# Altium project Team_01 COMPSYS 301 PCB.PrjPcb
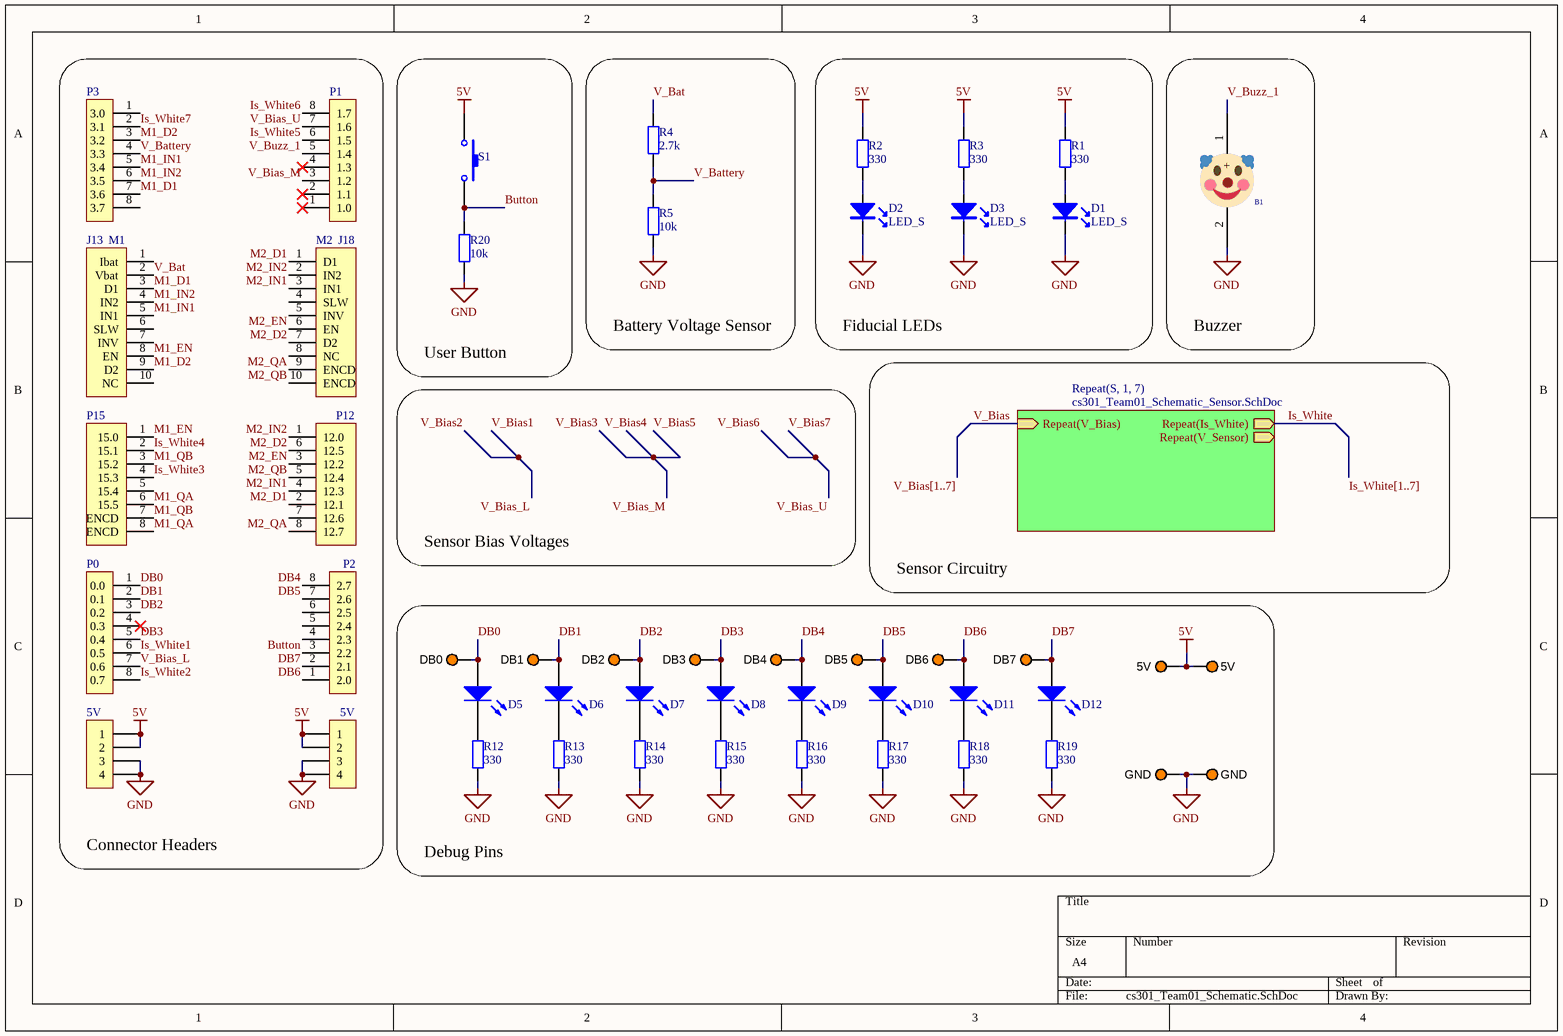
[diagram p0: cs301_Team01_Schematic.SchDoc]
2 sheets, 175 parts. Net scope: hierarchical (ports join the sheet entries above them; power ports are global).
Board file: cs301_Team01_Artwork.PcbDoc
Sheets:
  cs301_Team01_Schematic.SchDoc
    S1 = cs301_Team01_Schematic_Sensor.SchDoc
    S2 = cs301_Team01_Schematic_Sensor.SchDoc
    S3 = cs301_Team01_Schematic_Sensor.SchDoc
    S4 = cs301_Team01_Schematic_Sensor.SchDoc
    S5 = cs301_Team01_Schematic_Sensor.SchDoc
    S6 = cs301_Team01_Schematic_Sensor.SchDoc
    S7 = cs301_Team01_Schematic_Sensor.SchDoc

## Sheet cs301_Team01_Schematic.SchDoc
size A4; SheetNumber: 1; SheetTotal: 2

### Parts
5V  5V  [IDC4]  (value not drawn)
5V_1  5V  [TP_TH]
5V_2  5V  [TP_TH]
+5V  5V  [IDC4]
B1  clown  [Buzzer]  (value not drawn)
D1  LED_S  [LED0.1/5MM]
D2  LED_S  [LED0.1/5MM]
D3  LED_S  [LED0.1/5MM]
D5  0  [0805 LED]  (value not drawn)
D6  1  [0805 LED]  (value not drawn)
D7  2  [0805 LED]  (value not drawn)
D8  3  [0805 LED]  (value not drawn)
D9  4  [0805 LED]  (value not drawn)
D10  5  [0805 LED]  (value not drawn)
D11  6  [0805 LED]  (value not drawn)
D12  7  [0805 LED]  (value not drawn)
DB0  5003  [TP_TH]  (value not drawn)
DB1  5003  [TP_TH]  (value not drawn)
DB2  5003  [TP_TH]  (value not drawn)
DB3  5003  [TP_TH]  (value not drawn)
DB4  5003  [TP_TH]  (value not drawn)
DB5  5003  [TP_TH]  (value not drawn)
DB6  5003  [TP_TH]  (value not drawn)
DB7  5003  [TP_TH]  (value not drawn)
GND_1  GND  [TP_TH]
GND_2  GND  [TP_TH]
J13  M1  [idc10]
J18  M2  [IDC10]
P0  P0  [idc8]  (value not drawn)
P1  P1  [idc8]  (value not drawn)
P2  P2  [idc8]  (value not drawn)
P3  P3  [idc8]  (value not drawn)
P12  P12  [idc8]  (value not drawn)
P15  P15  [idc8]  (value not drawn)
R1  330  [0805 RES]
R2  330  [0805 RES]
R3  330  [0805 RES]
R4  2.7k  [0805 RES]
R5  10k  [0805 RES]
R12  330  [0805 RES]
R13  330  [0805 RES]
R14  330  [0805 RES]
R15  330  [0805 RES]
R16  330  [0805 RES]
R17  330  [0805 RES]
R18  330  [0805 RES]
R19  330  [0805 RES]
R20  10k  [0805 RES]
S1  PB switchTH_small  [ece-Sw-small]  (value not drawn)

### Blocks framed on the sheet
Connector Headers: 5V +5V J13 J18 P0-P3 P12 P15
User Button: R20 S1
Battery Voltage Sensor: R4 R5
Fiducial LEDs: D1-D3 R1-R3
Buzzer: B1
Debug Pins: 5V_1 5V_2 D5-D12 DB0-DB7 GND_1 GND_2 R12-R19

### Sub-sheets
Repeat(S, 1, 7) = cs301_Team01_Schematic_Sensor.SchDoc: Repeat(V_Bias) (in), Repeat(Is_White) (out), Repeat(V_Sensor) (out)

### Nets
5V: 5V.1 5V.2 5V_1.1 5V_2.1 +5V.1 +5V.2 R1.2 R2.2 R3.2 S1.1
GND: 5V.3 5V.4 +5V.3 +5V.4 B1.2(-) D1.K D2.K D3.K GND_1.1 GND_2.1 R5.1 R12.1 R13.1 R14.1 R15.1 R16.1 R17.1 R18.1 R19.1 R20.1
Button: P2.3(2.2) R20.2 S1.2
DB0: D5.1(A) DB0.1 P0.1(0.0)
DB1: D6.1(A) DB1.1 P0.2(0.1)
DB2: D7.1(A) DB2.1 P0.3(0.2)
DB3: D8.1(A) DB3.1 P0.5(0.4)
DB4: D9.1(A) DB4.1 P2.8(2.7)
DB5: D10.1(A) DB5.1 P2.7(2.6)
DB6: D11.1(A) DB6.1 P2.1(2.0)
DB7: D12.1(A) DB7.1 P2.2(2.1)
Is_White: sheet Repeat(S, 1, 7)/Repeat(Is_White)
Is_White1: P0.6(0.5)
Is_White2: P0.8(0.7)
Is_White3: P15.4(15.3)
Is_White4: P15.2(15.1)
Is_White5: P1.6(1.5)
Is_White6: P1.8(1.7)
Is_White7: P3.2(3.1)
M1_D1: J13.3(D1) P3.7(3.6)
M1_D2: J13.9(D2) P3.3(3.2)
M1_EN: J13.8(EN) P15.1(15.0)
M1_IN1: J13.5(IN1) P3.5(3.4)
M1_IN2: J13.4(IN2) P3.6(3.5)
M1_QA: P15.6(15.5) P15.8(ENCD)
M1_QB: P15.3(15.2) P15.7(ENCD)
M2_D1: J18.1(D1) P12.2(12.1)
M2_D2: J18.7(D2) P12.6(12.5)
M2_EN: J18.6(EN) P12.3(12.2)
M2_IN1: J18.3(IN1) P12.4(12.3)
M2_IN2: J18.2(IN2) P12.1(12.0)
M2_QA: J18.9(ENCD) P12.8(12.7)
M2_QB: J18.10(ENCD) P12.5(12.4)
V_Bat: J13.2(Vbat) R4.2
V_Battery: P3.4(3.3) R4.1 R5.2
V_Bias: sheet Repeat(S, 1, 7)/Repeat(V_Bias)
V_Bias1: P0.7(0.6)  [also labelled V_Bias2, V_Bias_L]
V_Bias3: P1.3(1.2)  [also labelled V_Bias4, V_Bias5, V_Bias_M]
V_Bias6: P1.7(1.6)  [also labelled V_Bias7, V_Bias_U]
V_Buzz_1: B1.1(+) P1.5(1.4)
NetD1_A: D1.A R1.1
NetD2_A: D2.A R2.1
NetD3_A: D3.A R3.1
NetD5_2: D5.2(K) R12.2
NetD6_2: D6.2(K) R13.2
NetD7_2: D7.2(K) R14.2
NetD8_2: D8.2(K) R15.2
NetD9_2: D9.2(K) R16.2
NetD10_2: D10.2(K) R17.2
NetD11_2: D11.2(K) R18.2
NetD12_2: D12.2(K) R19.2

Not connected (* = marked no-connect by the designer): J13 1(Ibat) 6(SLW) 7(INV) 10(NC); J18 4(SLW) 5(INV) 8(NC); P0 4(0.3)*; P1 1(1.0)* 2(1.1)* 4(1.3)*; P2 4(2.3) 5(2.4) 6(2.5); P3 1(3.0) 8(3.7); P12 7(12.6); P15 5(15.4)

### Buses and harness runs
bus Is_White[1..7]
bus V_Bias[1..7]

### Notes on the sheet
- Sensor Bias Voltages
- Sensor Circuitry

### Library data of the parts
5V +5V = CON4: Connector
5V_1 5V_2 DB0-DB7 GND_1 GND_2 = TestPoint: Test Point, Orange, 1-Pin THD, RoHS; Peak Reverse Current: 600 uA; Forward Current: 3 A; Max Surge Current: 80 A; Forward Voltage: 1.08 V; Max Operating Temperature: 150 degC; PackageReference: 5003; Pins: 2; ComponentLink2URL: http://keyelco.com/userAssets/file/M65p56.pdf; PackageDescription: 1-Pin Through Hole Device, Dia 2.54 mm; Weight: 0.01 lb; Diameter: 5.3 mm; Mount: Through Hole; Package Quantity: 500; Packaging: Bulk; Min Operating Temperature: -65 degC; ComponentLink1Description: Manufacturer URL; Height: 0.25 inch; ComponentLink1URL: http://www.keyelco.com/; ComponentLink2Description: Datasheet; Width: 0.25 inch; REACH SVHC: No SVHC; RoHSCompliant: true; Radiation Hardening: No; Length: 9.5 mm; DatasheetVersion: Jun-15
B1 = Buzzer
D1-D3 = LED
D5-D12 = LED_SMT_0805: SMT LED 0805 size; Manufacturer: Lite-On Inc.; Manufacturer Part Number: LTST-C170KGKT; Color: Green; Lens Color: Colorless; Lens Transparency: Clear; Millicandela Rating: 35mcd; Lens Style/Size: Rectangle with Flat Top, 1.40mm x 1.25mm; Voltage - Forward (Vf) (Typ): 2V; Current - Test: 20mA; Viewing Angle: 130°; Wavelength - Dominant: 571nm; Wavelength - Peak: 574nm; Supplier 1: Digi-Key; RoHS: RoHS Compliant; Category: Optoelectronics; Stock 1: 503069; Pricing 1: 1=0.62, 10=0.459, 25=0.338, 100=0.2415, 250=0.16416, 500=0.14486, 1000=0.11347 (NZD); Packaging: Cut Tape (CT); Part Status: Active; Mounting Type: Surface Mount; Features: -; Package / Case: 0805 (2012 Metric); Size / Dimension: 2.00mm L x 1.25mm W; Height (Max): 1.10mm; ComponentLink1URL: http://optoelectronics.liteon.com/upload/download/DS22-2000-073/LTST-C170KGKT.pdf; ComponentLink1Description: http://optoelectronics.liteon.com/upload/download/DS22-2000-073/LTST-C170KGKT.pdf; Supplier Part Number 1: 160-1414-1-ND
J13 J18 = CON10: Connector
P0-P3 = CON8: Connector
P12 P15 = CON8_1: Connector
R1-R5 R12-R20 = Res_SMT_0805: 0805 resistor; Published: 8-Jun-2000; LatestRevisionDate: 17-Jul-2002; LatestRevisionNote: Re-released for DXP Platform.; PackageReference: AXIAL-0.4; Publisher: Altium Limited; Value: *; ComponentLink1Description: https://nz.mouser.com/datasheet/2/315/AOA0000C304-1149620.pdf
S1 = PB switchTH_small: Push Button Switch thru hole

## Sheet cs301_Team01_Schematic_Sensor.SchDoc: Sensor Processing
size A4; Date: 06/08/2023; DrawnBy: Viktor Neshikj; Revision: 1.0; SheetNumber: 2; SheetTotal: 2
Used 7 times, as channels S1, S2, S3, S4, S5, S6, S7. Parts and nets are listed once, with the designators drawn on the sheet.
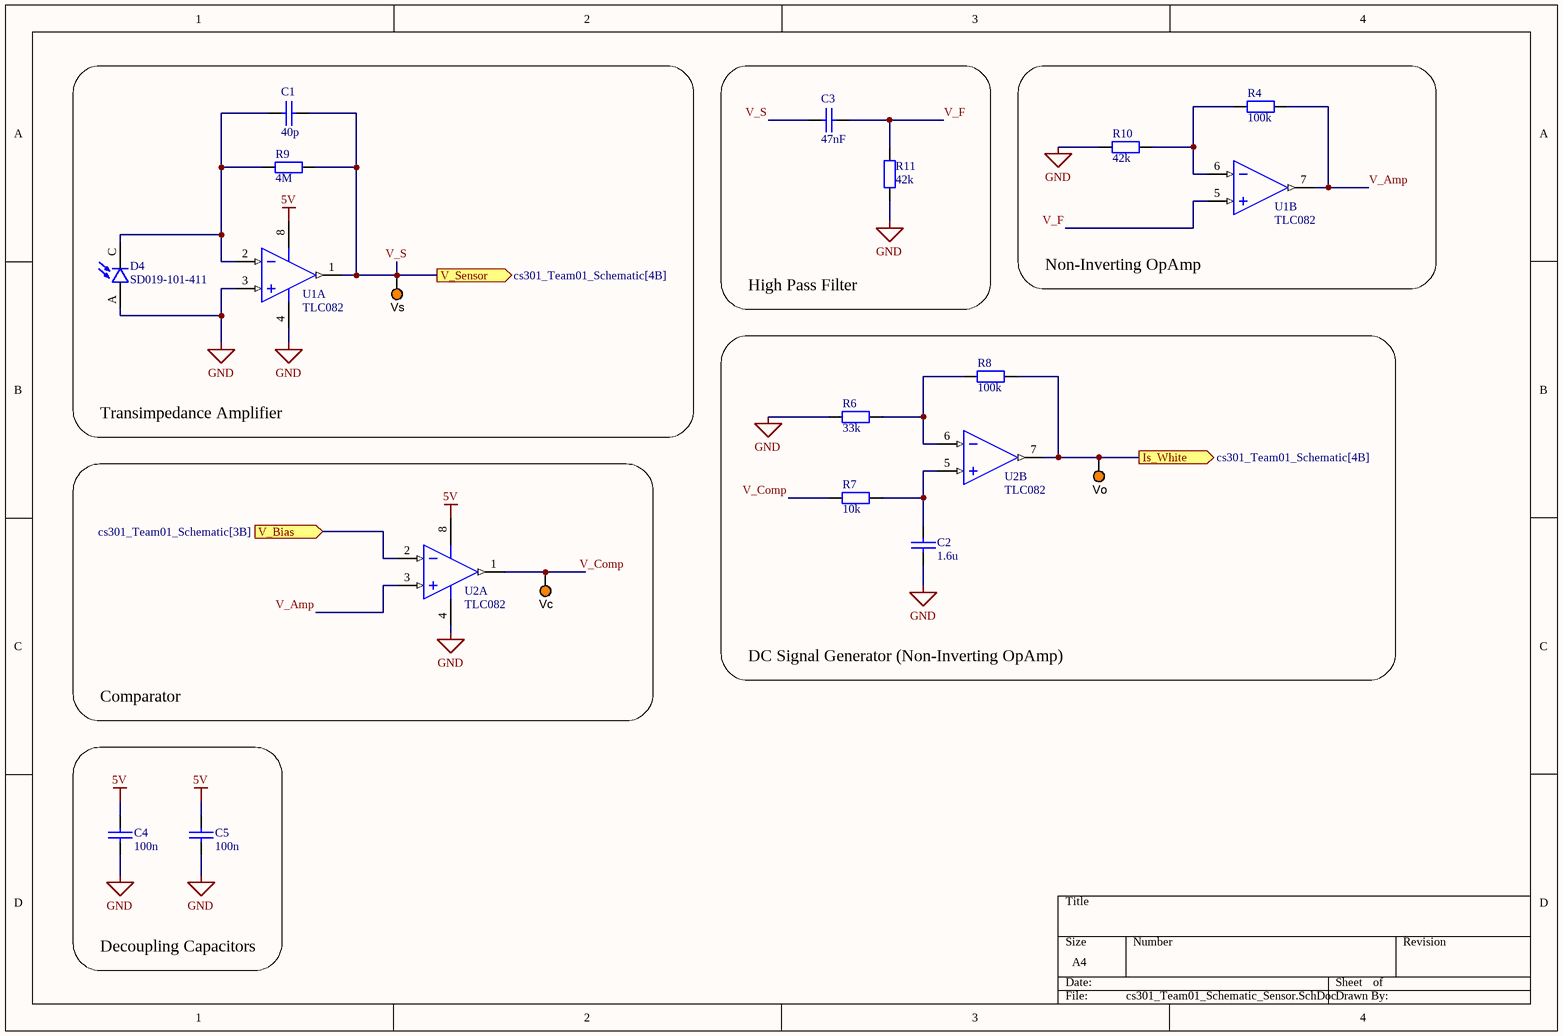
[diagram p1: cs301_Team01_Schematic_Sensor.SchDoc]

### Parts
C1  40p  [0805 CAP]
C2  1.6u  [0805 CAP]
C3  47nF  [0805 CAP]
C4  100n  [0805 CAP]
C5  100n  [0805 CAP]
D4  SD019-101-411  [XDCR_TEMD7000X01]
R4  100k  [0805 RES]
R6  33k  [0805 RES]
R7  10k  [0805 RES]
R8  100k  [0805 RES]
R9  4M  [0805 RES]
R10  42k  [0805 RES]
R11  42k  [0805 RES]
U1  TLC082  [SO - 8]  (parts A,B of 2)
U2  TLC082  [SO - 8]  (parts A,B of 2)
Vc  5003  [TP_TH]  (value not drawn)
Vo  5003  [TP_TH]  (value not drawn)
Vs  5003  [TP_TH]  (value not drawn)

### Blocks framed on the sheet
Transimpedance Amplifier: C1 D4 R9 U1 Vs
High Pass Filter: C3 R11
Non-Inverting OpAmp: R4 R10 U1
DC Signal Generator (Non-Inverting OpAmp): C2 R6-R8 U2 Vo
Comparator: U2 Vc
Decoupling Capacitors: C4 C5

### Ports
Is_White (out, see cs301_Team01_Schematic[4B]), V_Bias (in, see cs301_Team01_Schematic[3B]), V_Sensor (out, see cs301_Team01_Schematic[4B])

### Nets
5V: C4.1 C5.1 U1.8(VDD) U2.8(VDD)
GND: C2.1 C4.2 C5.2 D4.A R6.2 R10.1 R11.1 U1.3(VINA+) U1.4(VSS) U2.4(VSS)
Is_White: R8.1 U2.7(VOUTA) Vo.1 ; port Is_White
V_Amp: R4.2 U1.7(VOUTA) U2.3(VINA+)
V_Bias: U2.2(VINA-) ; port V_Bias
V_Comp: R7.2 U2.1(VOUTA) Vc.1
V_F: C3.2 R11.2 U1.5(VINA+)
V_S: C1.2 C3.1 R9.2 U1.1(VOUTA) Vs.1 ; port V_Sensor
NetC1_1: C1.1 D4.C R9.1 U1.2(VINA-)
NetC2_2: C2.2 R7.1 U2.5(VINA+)
NetR4_1: R4.1 R10.2 U1.6(VINA-)
NetR6_1: R6.1 R8.2 U2.6(VINA-)

### Channels
S1: designators end in _S1; ports Is_White=Is_White1 V_Bias=V_Bias1 V_Sensor=V_S_S1
S2: designators end in _S2; ports Is_White=Is_White2 V_Bias=V_Bias1 V_Sensor=V_S_S2
S3: designators end in _S3; ports Is_White=Is_White3 V_Bias=V_Bias3 V_Sensor=V_S_S3
S4: designators end in _S4; ports Is_White=Is_White4 V_Bias=V_Bias3 V_Sensor=V_S_S4
S5: designators end in _S5; ports Is_White=Is_White5 V_Bias=V_Bias3 V_Sensor=V_S_S5
S6: designators end in _S6; ports Is_White=Is_White6 V_Bias=V_Bias6 V_Sensor=V_S_S6
S7: designators end in _S7; ports Is_White=Is_White7 V_Bias=V_Bias6 V_Sensor=V_S_S7

### Library data of the parts
C1-C5 = CerCap_SMT_0805: SMT ceramic capacitor 0805 size; Value: *
D4 = TEMD7000X01: Photodiode SD019-101-411; MF: Vishay Semiconductor; Price: None; Purchase-URL: https://pricing.snapeda.com/search/part/TEMD7000X01/?ref=eda; Value: *; Check_prices: https://www.snapeda.com/parts/TEMD7000X01/Vishay+Semiconductor+Opto+Division/view-part/?ref=eda; Package: 0805 Vishay; SnapEDA_Link: https://www.snapeda.com/parts/TEMD7000X01/Vishay+Semiconductor+Opto+Division/view-part/?ref=snap; Availability: In Stock; MP: TEMD7000X01
R4 R6-R11 = Res_SMT_0805: 0805 resistor; Published: 8-Jun-2000; LatestRevisionDate: 17-Jul-2002; LatestRevisionNote: Re-released for DXP Platform.; PackageReference: AXIAL-0.4; Publisher: Altium Limited; Value: *; ComponentLink1Description: https://nz.mouser.com/datasheet/2/315/AOA0000C304-1149620.pdf
U1 U2 = TLC082_SMT_SOIC8: IC OPAMP GP 10MHZ 8SOIC; Manufacturer: Texas Instruments; Manufacturer Part Number: TLC082CDR; Amplifier Type: General Purpose; Slew Rate: 19 V/µs; Current - Supply: 1.9mA; Voltage - Supply, Single/Dual (±): 4.5 V ~ 16 V, ±2.25 V ~ 8 V; Supplier 1: Digi-Key; RoHS: RoHS Compliant; Category: Integrated Circuits (ICs); Stock 1: 29765; Pricing 1: 1=3.44, 10=3.087, 100=2.4808, 500=2.03822, 1000=1.68881 (NZD); Packaging: Cut Tape (CT); Part Status: Active; Output Type: -; Operating Temperature: 0°C ~ 70°C; Mounting Type: Surface Mount; Package / Case: 8-SOIC (0.154", 3.90mm Width); Supplier Device Package: 8-SOIC; Base Part Number: TLC082; ComponentLink1URL: http://www.ti.com/lit/ds/symlink/tlc080a.pdf; ComponentLink1Description: http://www.ti.com/lit/ds/symlink/tlc080a.pdf; Supplier Part Number 1: 296-2421-1-ND
Vc Vo Vs = TestPoint: as 5V_1 on sheet cs301_Team01_Schematic; Max Operating Temperature: 150 degC; PackageReference: 5003; Pins: 2; ComponentLink2URL: http://keyelco.com/userAssets/file/M65p56.pdf; PackageDescription: 1-Pin Through Hole Device, Dia 2.54 mm; Weight: 0.01 lb; Diameter: 5.3 mm; Mount: Through Hole; Package Quantity: 500; Packaging: Bulk; Min Operating Temperature: -65 degC; ComponentLink1Description: Manufacturer URL; Height: 0.25 inch; ComponentLink1URL: http://www.keyelco.com/; ComponentLink2Description: Datasheet; Width: 0.25 inch; REACH SVHC: No SVHC; RoHSCompliant: true; Radiation Hardening: No; Length: 9.5 mm; DatasheetVersion: Jun-15

## Nets that join several sheets
5V: cs301_Team01_Schematic (10 pins), S1 (C4_S1.1 C5_S1.1 U1_S1.8 U2_S1.8), S2 (C4_S2.1 C5_S2.1 U1_S2.8 U2_S2.8), S3 (C4_S3.1 C5_S3.1 U1_S3.8 U2_S3.8), S4 (C4_S4.1 C5_S4.1 U1_S4.8 U2_S4.8), S5 (C4_S5.1 C5_S5.1 U1_S5.8 U2_S5.8), S6 (C4_S6.1 C5_S6.1 U1_S6.8 U2_S6.8), S7 (C4_S7.1 C5_S7.1 U1_S7.8 U2_S7.8)
GND: cs301_Team01_Schematic (20 pins), S1 (10 pins), S2 (10 pins), S3 (10 pins), S4 (10 pins), S5 (10 pins), S6 (10 pins), S7 (10 pins)
Is_White1: cs301_Team01_Schematic (P0.6), S1 (R8_S1.1 U2_S1.7 Vo_S1.1)
Is_White2: cs301_Team01_Schematic (P0.8), S2 (R8_S2.1 U2_S2.7 Vo_S2.1)
Is_White3: cs301_Team01_Schematic (P15.4), S3 (R8_S3.1 U2_S3.7 Vo_S3.1)
Is_White4: cs301_Team01_Schematic (P15.2), S4 (R8_S4.1 U2_S4.7 Vo_S4.1)
Is_White5: cs301_Team01_Schematic (P1.6), S5 (R8_S5.1 U2_S5.7 Vo_S5.1)
Is_White6: cs301_Team01_Schematic (P1.8), S6 (R8_S6.1 U2_S6.7 Vo_S6.1)
Is_White7: cs301_Team01_Schematic (P3.2), S7 (R8_S7.1 U2_S7.7 Vo_S7.1)
V_Bias1: cs301_Team01_Schematic (P0.7), S1 (U2_S1.2), S2 (U2_S2.2)
V_Bias3: cs301_Team01_Schematic (P1.3), S3 (U2_S3.2), S4 (U2_S4.2), S5 (U2_S5.2)
V_Bias6: cs301_Team01_Schematic (P1.7), S6 (U2_S6.2), S7 (U2_S7.2)